# EAGLE design tinyJTAG-v10 (EAGLE 6.2)
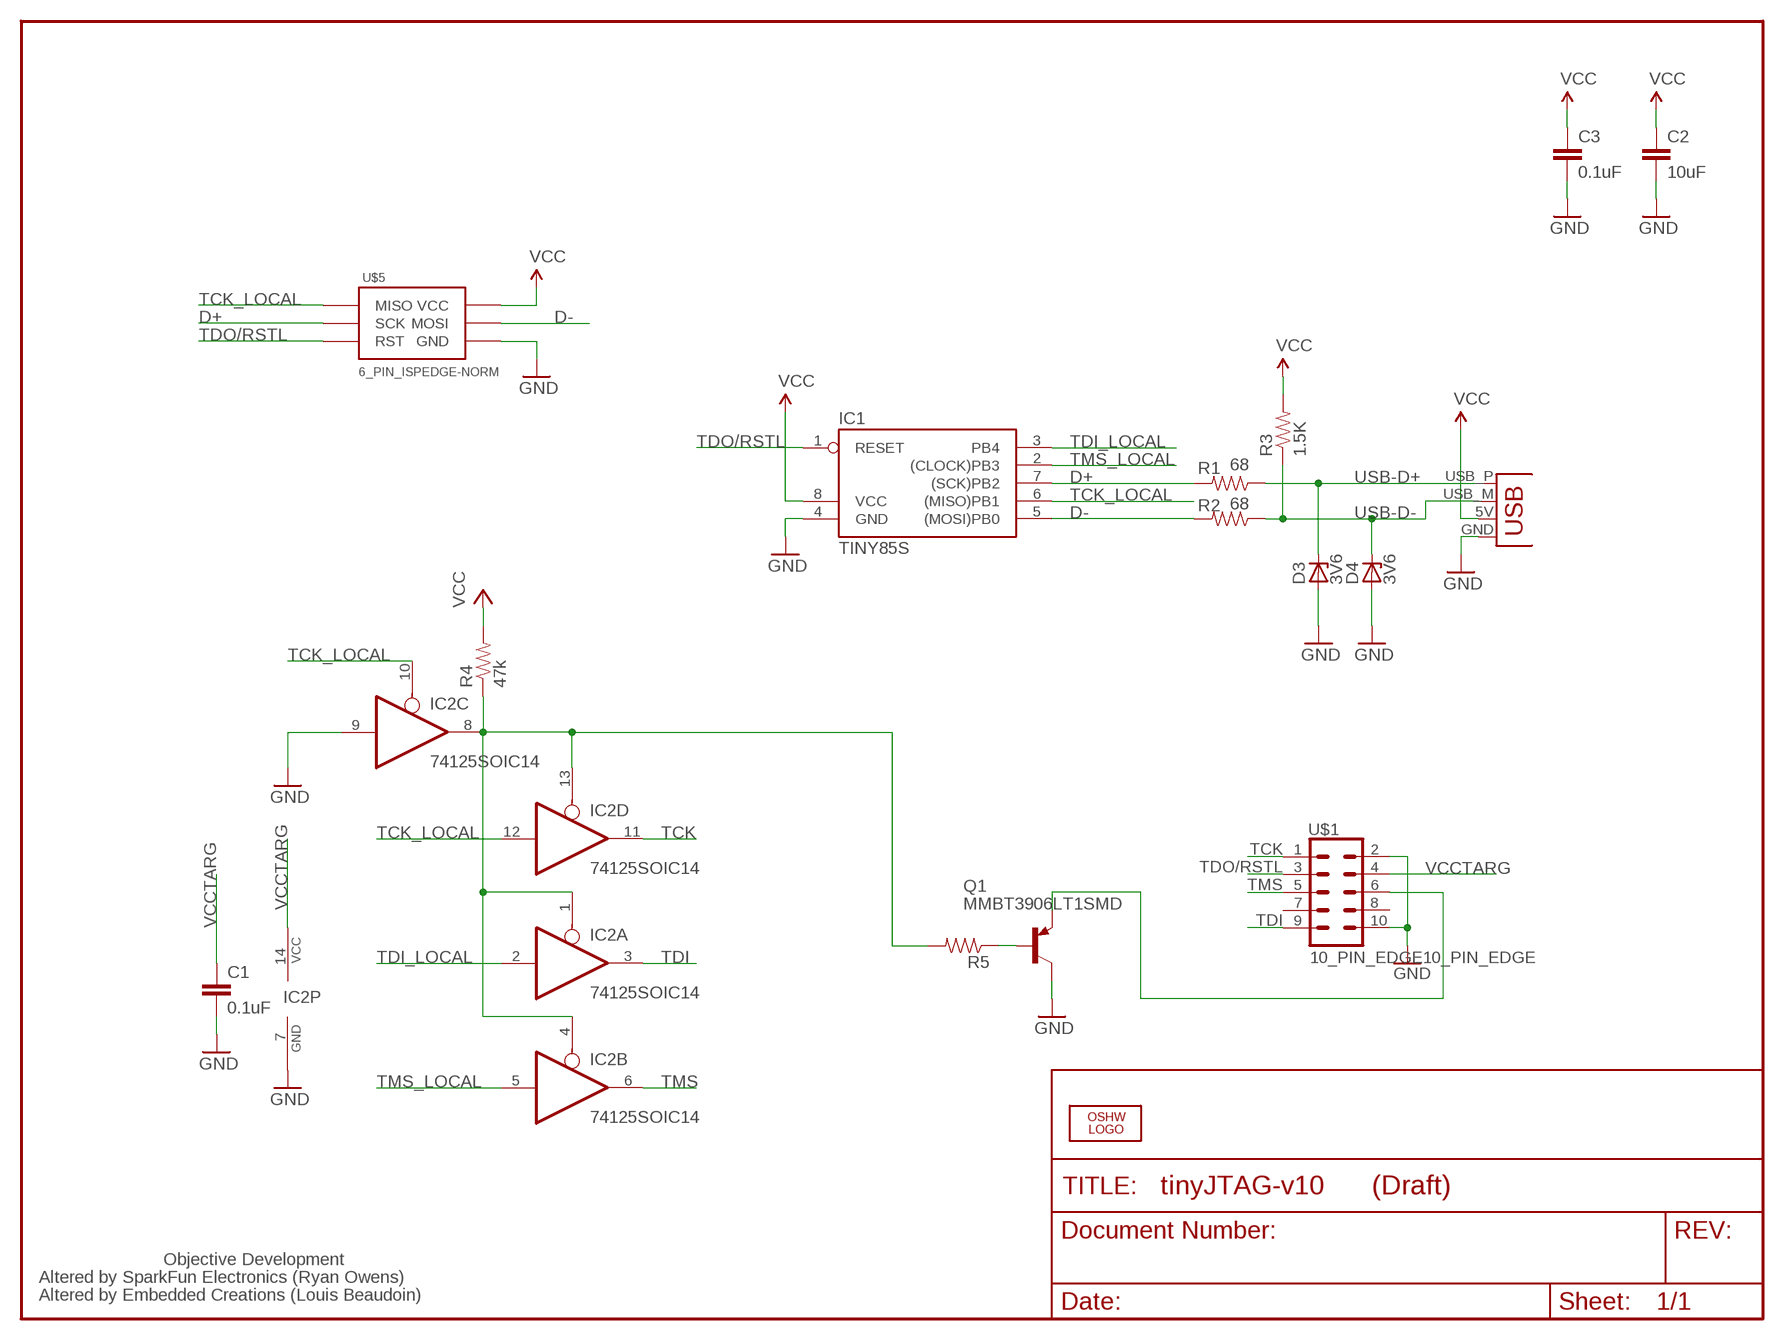
[diagram p0: schematic, sheet 1]

## Parts
C1  0.1uF  CAP0603-CAP  [0603-CAP]
C2  10uF  C-EUC0805  [C0805]
C3  0.1uF  CAP0603-CAP  [0603-CAP]
D3  3V6  ZENER-DIODESOD323  [DIODE_SOD323-W]
D4  3V6  ZENER-DIODESOD323  [DIODE_SOD323-W]
IC1  TINY85S  [SOIC8]
IC2  74125SOIC14  [SO14]
LOGO1  OSHW_LOGO_FILLX0150-NT  [OSHW_FILLX150_NOTEXT]
Q1  MMBT3906LT1SMD  [SOT23-BEC]
R1  68  RESISTOR0603-RES  [0603-RES]
R2  68  RESISTOR0603-RES  [0603-RES]
R3  1.5K  RESISTOR0603-RES  [0603-RES]
R4  47k  RESISTOR0603-RES  [0603-RES]
R5  RESISTOR0603-RES  [0603-RES]
U$1  10_PIN_EDGE10_PIN_EDGE  [10_PIN_EDGE]
U$5  6_PIN_ISPEDGE-NORM  [6_PIN_EDGE]
X1  USBPCB  [USB-A-PCB]

## Nets
D+: IC1.7((SCK)PB2) R1.2 U$5.3(SCK)
D-: IC1.5((MOSI)PB0) R2.2 U$5.4(MOSI)
GND: C1.2 C2.2 C3.2 D3.A D4.A IC1.4(GND) IC2.7(P:GND) IC2.9(C:I) Q1.C U$1.2 U$1.10 U$5.6(GND) X1.GND
N$1: IC2.1(A:OE) IC2.4(B:OE) IC2.8(C:O) IC2.13(D:OE) R4.1 R5.2
N$3: Q1.E U$1.6
N$4: Q1.B R5.1
TCK: IC2.11(D:O) U$1.1
TCK_LOCAL: IC1.6((MISO)PB1) IC2.10(C:OE) IC2.12(D:I) U$5.1(MISO)
TDI: IC2.3(A:O) U$1.9
TDI_LOCAL: IC1.3(PB4) IC2.2(A:I)
TDO/RSTL: IC1.1(RESET) U$1.3 U$5.5(RST)
TMS: IC2.6(B:O) U$1.5
TMS_LOCAL: IC1.2((CLOCK)PB3) IC2.5(B:I)
USB-D+: D3.C R1.1 X1.USB_P(D+)
USB-D-: D4.C R2.1 R3.1 X1.USB_M(D-)
VCC: C2.1 C3.1 IC1.8(VCC) R3.2 R4.2 U$5.2(VCC) X1.5V(VBUS)
VCCTARG: C1.1 IC2.14(P:VCC) U$1.4
Unconnected: U$1.7 U$1.8

## Notes on the sheet
- (Draft)
- Objective Development
- Altered by SparkFun Electronics (Ryan Owens)
- Altered by Embedded Creations (Louis Beaudoin)

## Library data of the parts
C1 C3 = SparkFun:CAP: Capacitor Standard 0603 ceramic capacitor, and 0.1" leaded capacitor.
C2 = rcl:C-EU: CAPACITOR, European symbol
D3 D4 = eclibrary:ZENER-DIODE: Z-Diode
IC1 = atmel:TINY85: MICROCONTROLLER 1K ROM 128 bytes RAM 128 bytes EEPROM
IC2 = eclibrary:74*125: Quad bus BUFFER, 3-state
LOGO1 = ohw-logo:OSHW_LOGO_FILL
Q1 = transistor-pnp:MMBT3906*: PNP Transistror
R1-R5 = SparkFun:RESISTOR: Resistor Basic schematic elements and footprints for 0603, 1206, and PTH 1/10th watt (small) resistors.
U$1 = eclibrary:10_PIN_EDGE
U$5 = ppeter:6_PIN_ISP: AVR 6 PIN ISP header Edge connector normal layout
X1 = SparkFun:USB: USB Connectors USB-B-PTH is fully proven SKU : PRT-00139 USB-miniB is fully proven SKU : PRT-00587 USB-A-PCB is untested. USB-A-H is throughly reviewed, but untested. Spark Fun Electronics SKU : PRT-00437 USB-B-SMT is throughly reviewed, but untested. Needs silkscreen touching up. USB-A-S has not been used/tested USB-MB-H has not been used/tested

## Net classes
1 supply: width 0.254 mm

## Board
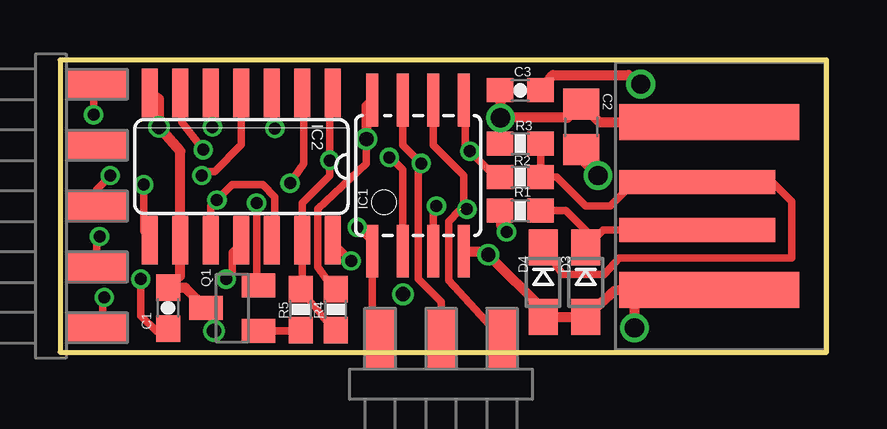
[diagram p1: board, top side]
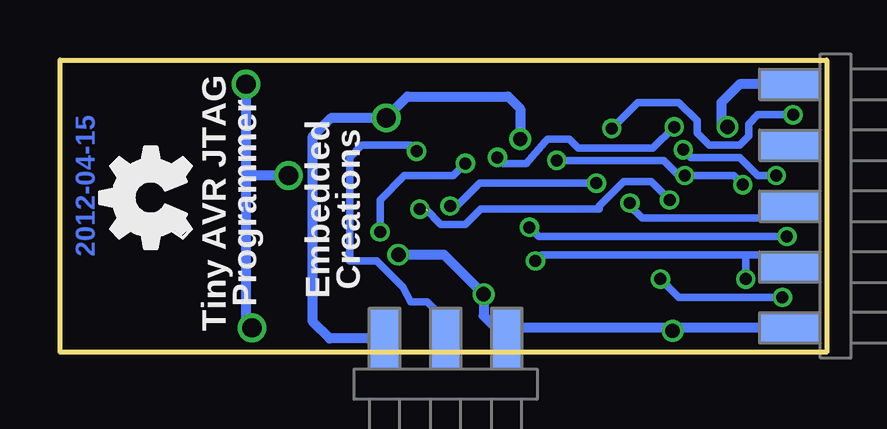
[diagram p2: board, bottom side, seen from below]

Size 31.94 x 12.19 mm. Coordinates in mm from the lower left corner, seen from the top.
Outline: 0,0 31.94,0 31.94,12.19 0,12.19 0,0
Copper layers (1*16): Top 0.035mm / dielectric 1.5mm / Bottom 0.035mm
Design rules: minimum track width 6mil, minimum drill 12mil, track to track 6mil, track to pad 6mil, pad to pad 6mil, via to via 6mil, smd to smd 0mil, copper to edge 10mil, drill to drill 10mil, minimum pad ring 12mil, minimum via ring 6mil, stop-mask expansion 2mil, vias tented up to drill 100mil, thermal gap 10mil

### Footprints (pad centres in the part's own frame; a part is rotated, then mirrored left to right if it is on the bottom)
0603-CAP = smd 1.1 x 1: 1 -0.85,0; 2 0.85,0
C0805 = smd 1.3 x 1.5: 1 -0.95,0; 2 0.95,0
DIODE_SOD323-W = smd 1.5 x 1.2: A 1.45,0; C -1.45,0
SOIC8 = smd 0.5 x 2.2: 1 -1.905,-3.154; 2 -0.645,-3.154; 3 0.625,-3.154; 4 1.895,-3.154; 5 1.905,3.154; 6 0.635,3.154; 7 -0.635,3.154; 8 -1.905,3.154
SO14 = smd 0.66 x 2.032: 1 -3.81,-3.073; 2 -2.54,-3.073; 3 -1.27,-3.073; 4 0,-3.073; 5 1.27,-3.073; 6 2.54,-3.073; 7 3.81,-3.073; 8 3.81,3.073; 9 2.54,3.073; 10 1.27,3.073; 11 0,3.073; 12 -1.27,3.073; 13 -2.54,3.073; 14 -3.81,3.073
SOT23-BEC = smd 1 x 1.4: B -0.95,-1.1; C 0,1.1; E 0.95,-1.1
0603-RES = smd 1.1 x 1: 1 -0.85,0; 2 0.85,0
10_PIN_EDGE = smd 1.27 x 2.54: 1 5.08,0; 3 2.54,0; 5 0,0; 7 -2.54,0; 9 -5.08,0 | smd 1.27 x 2.54 bottom: 2 5.08,0; 4 2.54,0; 6 0,0; 8 -2.54,0; 10 -5.08,0
6_PIN_EDGE = smd 1.27 x 2.54: 1 2.54,0; 3 0,0; 5 -2.54,0 | smd 1.27 x 2.54 bottom: 2 2.54,0; 4 0,0; 6 -2.54,0
USB-A-PCB = smd 7.5 x 1.5: 5V -0.2,-3.5; GND -0.2,3.5 | smd 6.5 x 1: USB_M 0.3,-1; USB_P 0.3,1

### Placement (x,y rotation side)
C1  4.51,1.84 90 top
C2  21.72,9.4 270 top
C3  19.18,10.92 0 top
D3  21.91,2.92 270 top
D4  20.13,2.92 270 top
IC1  14.92,7.37 0 top
IC2  7.56,7.75 180 top
LOGO1  26.48,4.32 90 bottom
Q1  7.18,1.84 90 top
R1  19.18,5.91 180 top
R2  19.18,7.3 180 top
R3  19.18,8.7 180 top
R4  11.49,1.78 90 top
R5  10.03,1.78 90 top
U$1  1.52,6.1 270 top
U$5  15.88,0.57 0 top
X1  26.86,6.1 180 top

### Tracks (layer width: path | path; a pad name or v marks a point on that pad's centre or on a via)
D+  (via drill 0.5)
  Top 0.305: IC1.7 14.29,8.64 v15.05,7.87 14.92,7.75 14.92,3.05 15.88,2.1 U$5.3 | R1.2 18.33,5.29 v18.61,5.02
  Bottom 0.305: v15.05,7.87 15.56,7.37 17.59,7.37 18.61,6.35 v18.61,5.02
D-  (via drill 0.5)
  Top 0.305: IC1.5 16.89,10.46 16.89,8.57 v17.08,8.38 17.97,7.49 18.01,7.49 R2.2
  Bottom 0.305: U$5.4 16.32,1.71 16.32,1.78 16.64,2.1 17.34,2.1 17.65,2.73 18.73,3.81 19.88,3.81 19.88,8.13 19.37,8.64 17.34,8.64 v17.08,8.38
GND  (via drill 0.6, 0.8)
  Top 0.305: 4.99,4.52 IC2.9
  Top 0.406: 27.11,2.54 27.05,2.54 26.99,2.48 27.05,2.48 27.11,2.54 | 27.11,2.54 X1.GND 24.19,2.6 | 24.19,2.6 23.16,2.6 D3.A D4.A 20.13,1.78 v17.84,4.06 17.7,4.21 IC1.4 | C3.2 20.54,11.56 23.69,11.56 v24.19,11.18 | v23.94,1.02 23.94,2.34 24.19,2.6 | C2.2 21.72,8.06 v22.42,7.37 | IC2.7 4.13,10.57 v4.13,9.4 5.02,8.38 IC2.9 | v6.41,0.89 6.41,1.5 Q1.C 5.23,2.69 C1.2 4.99,3.17 4.99,4.52
  Bottom 0.305: 12.95,0.57 U$5.6 13.14,0.76
  Bottom 0.406: v24.19,11.18 24.19,7.37 | 24.19,7.37 24.19,1.27 v23.94,1.02 | v22.42,7.37 24.19,7.37 | U$1.10 3.62,11.18 4.38,10.41 4.38,9.4 v4.13,9.4 | v17.84,4.06 15.94,4.06 v14.29,2.41 14.29,1.52 U$5.6 12.89,1.02 6.41,1.02 | U$1.2 6.41,1.02 | v6.41,0.89 6.41,1.02
  pour Bottom (isolate 6.452): 0,12.19 31.94,12.19 31.94,0 0,0
  pour Top (isolate 6.452): 0,0 0,12.19 31.94,12.19 31.94,0
N$1  (via drill 0.5)
  Top 0.305: 10.03,2.6 R5.2 | R5.2 10.03,3.05 | IC2.1 11.24,10.57 v11.24,8 11.24,7.37 10.1,6.22 IC2.13 10.1,2.69 R5.2 | IC2.8 3.49,5.05 v3.49,6.99 | R4.1 10.99,1.42 R5.2 | IC2.4 7.56,8.66 6.44,7.54 6.08,7.54 v5.91,7.37
  Bottom 0.305: v3.49,6.99 3.87,7.37 v5.91,7.37 6.16,7.37 6.79,8 v11.24,8
N$3  (via drill 0.5)
  Top 0.305: Q1.E 8.19,3.34 v8.19,6.22
  Bottom 0.305: U$1.6 2.03,5.59 7.68,5.59 8.19,6.1 v8.19,6.22
N$4
  Top 0.305: Q1.B 10,0.89 R5.1
TCK  (via drill 0.5)
  Top 0.305: U$1.1 1.78,1.02 1.78,2.22 v1.84,2.29 | v6.92,3.05 7.18,3.3 7.18,4.17 7.43,4.42 7.43,4.55 IC2.11
  Bottom 0.305: v1.84,2.29 6.16,2.29 v6.92,3.05
TCK_LOCAL  (via drill 0.5)  (1 unrouted)
  Top 0.305: U$5.1 16.19,2.98 16.19,5.46 16.64,5.91 | IC2.10 6.29,6.1 v6.54,6.35 7.18,6.99 8.45,6.99 8.95,6.48 8.95,5.59 8.83,5.46 IC2.12 | IC1.6 15.56,8.64 16.83,7.37 16.83,6.1 v16.95,5.97
  Bottom 0.305: v16.95,5.97 16.7,5.97 16.07,5.33 15.05,5.33 14.41,5.97 9.46,5.97 9.46,6.1 8.45,7.11 7.3,7.11 v6.54,6.35
TDI  (via drill 0.5)
  Top 0.305: v8.95,9.34 IC2.3 | U$1.9 1.4,11.05 v1.4,9.91
  Bottom 0.305: v1.4,9.91 2.86,9.91 3.24,9.53 3.24,9.02 3.62,8.64 4.89,8.64 5.4,9.14 5.4,9.65 6.16,10.41 7.87,10.41 v8.95,9.34
TDI_LOCAL  (via drill 0.5)
  Top 0.305: v9.59,7.05 10.16,7.87 10.16,10.76 IC2.2 | IC1.3 15.55,5.96 v15.68,6.1
  Bottom 0.305: 9.65,6.86 v9.59,7.05 14.46,7.05 15.41,6.1 v15.68,6.1
TDO/RSTL  (via drill 0.5)
  Top 0.305: 1.52,3.37 U$1.3 1.52,4.7 v1.65,4.83 | v12.38,5.21 13.02,4.64 IC1.1 12.91,4.21 13.02,3.43 13.02,0.89 U$5.5
  Bottom 0.305: v1.65,4.83 12,4.83 v12.38,5.21
TMS  (via drill 0.5)
  Top 0.305: 1.97,5.91 U$1.5 1.52,6.79 v2.1,7.37 | v5.97,8.45 5.08,9.59 IC2.6
  Bottom 0.305: v5.97,8.45 5.65,8.13 3.62,8.13 2.86,7.37 v2.1,7.37
TMS_LOCAL  (via drill 0.5)
  Top 0.305: IC1.2 14.29,4.22 14.29,7.62 13.97,7.94 13.97,8.06 v13.72,8.13 | IC2.5 v6.35,9.4
  Bottom 0.305: v6.35,9.4 7.24,8.51 10.35,8.51 10.73,8.89 11.62,8.89 11.75,8.76 12.51,7.87 13.46,7.87 v13.72,8.13
USB-D+
  Top 0.305: X1.USB_P 22.63,5.1 22.26,4.73 | 22.26,4.73 D3.C 21.78,4.5 | R1.1 21.08,5.91 22.26,4.73
USB-D-
  Top 0.305: D4.C 20.95,3.24 22.67,3.24 23.3,3.94 30.48,3.94 30.48,6.29 29.72,7.05 26.61,7.05 X1.USB_M 26.54,7.11 23.94,7.11 22.92,6.1 21.91,6.1 20.7,7.3 R2.1 R3.1
VCC  (via drill 0.6, 0.8)
  Top 0.305: C3.1 18.39,10.86 | 13.02,10.03 12.95,10.58 IC1.8 | v12.76,8.89 12.76,7.87 10.73,5.97 10.73,3.56 11.41,2.63 R4.2
  Top 0.406: X1.5V 22.47,9.6 C2.1 21.15,9.78 v18.35,9.78 | R3.2 18.35,8.72 v18.35,9.78 | C3.1 18.35,10.9 v18.35,9.78 | IC1.8 12.76,10.27 v12.76,8.89
  Bottom 0.406: v18.35,9.78 17.46,10.67 13.27,10.67 12.76,10.16 v12.76,8.89 | 18.99,9.78 v18.35,9.78 | U$5.2 20.7,0.57 21.4,1.27 21.4,9.02 20.64,9.78 v18.35,9.78
VCCTARG  (via drill 0.5)
  Top 0.305: C1.1 4.03,0.86 3.37,1.52 v3.37,3.05 | v12.13,3.81 11.37,4.57 IC2.14
  Top 0.406: IC2.14 11.49,4.57
  Bottom 0.305: U$1.4 2.03,4.06 3.37,4.06 | 3.37,4.06 11.87,4.06 v12.13,3.81 | v3.37,3.05 3.37,4.06

### Text on the board
Bottom: 2012-04-15
bPlace: Creations | Embedded | Programmer | Tiny AVR JTAG
Document: Released under the Creative Commons Attribution Share-Alike 3.0 License | http://creativecommons.org/licenses/by-sa/3.0 | Designed by: | Objective Development | Altered by SparkFun Electronics (Ryan Owens) | Altered by Embedded Creations (Louis Beaudoin)